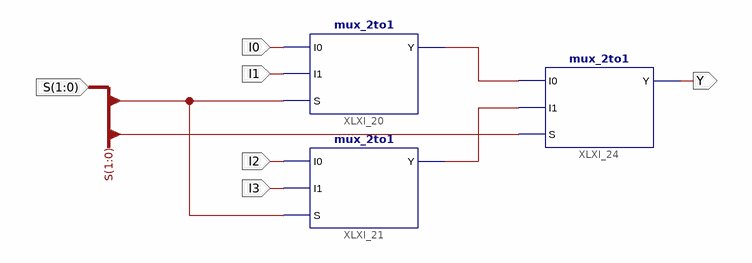
[diagram p0: schematic sheet 1]
// Xilinx ISE schematic mux_4to1.sch (virtex6) as structural Verilog: 3 symbols, 6 ports
module mux_4to1 (
  input  [1:0] S,
  input  I0,
  input  I1,
  input  I2,
  input  I3,
  output Y
);

  wire XLXN_1, XLXN_2;

  mux_2to1 XLXI_20 (.I0(I0), .I1(I1), .S(S[0]), .Y(XLXN_1));
  mux_2to1 XLXI_21 (.I0(I2), .I1(I3), .S(S[0]), .Y(XLXN_2));
  mux_2to1 XLXI_24 (.I0(XLXN_1), .I1(XLXN_2), .S(S[1]), .Y(Y));
endmodule
